# EAGLE design 72x8 control (EAGLE 8.7.0)
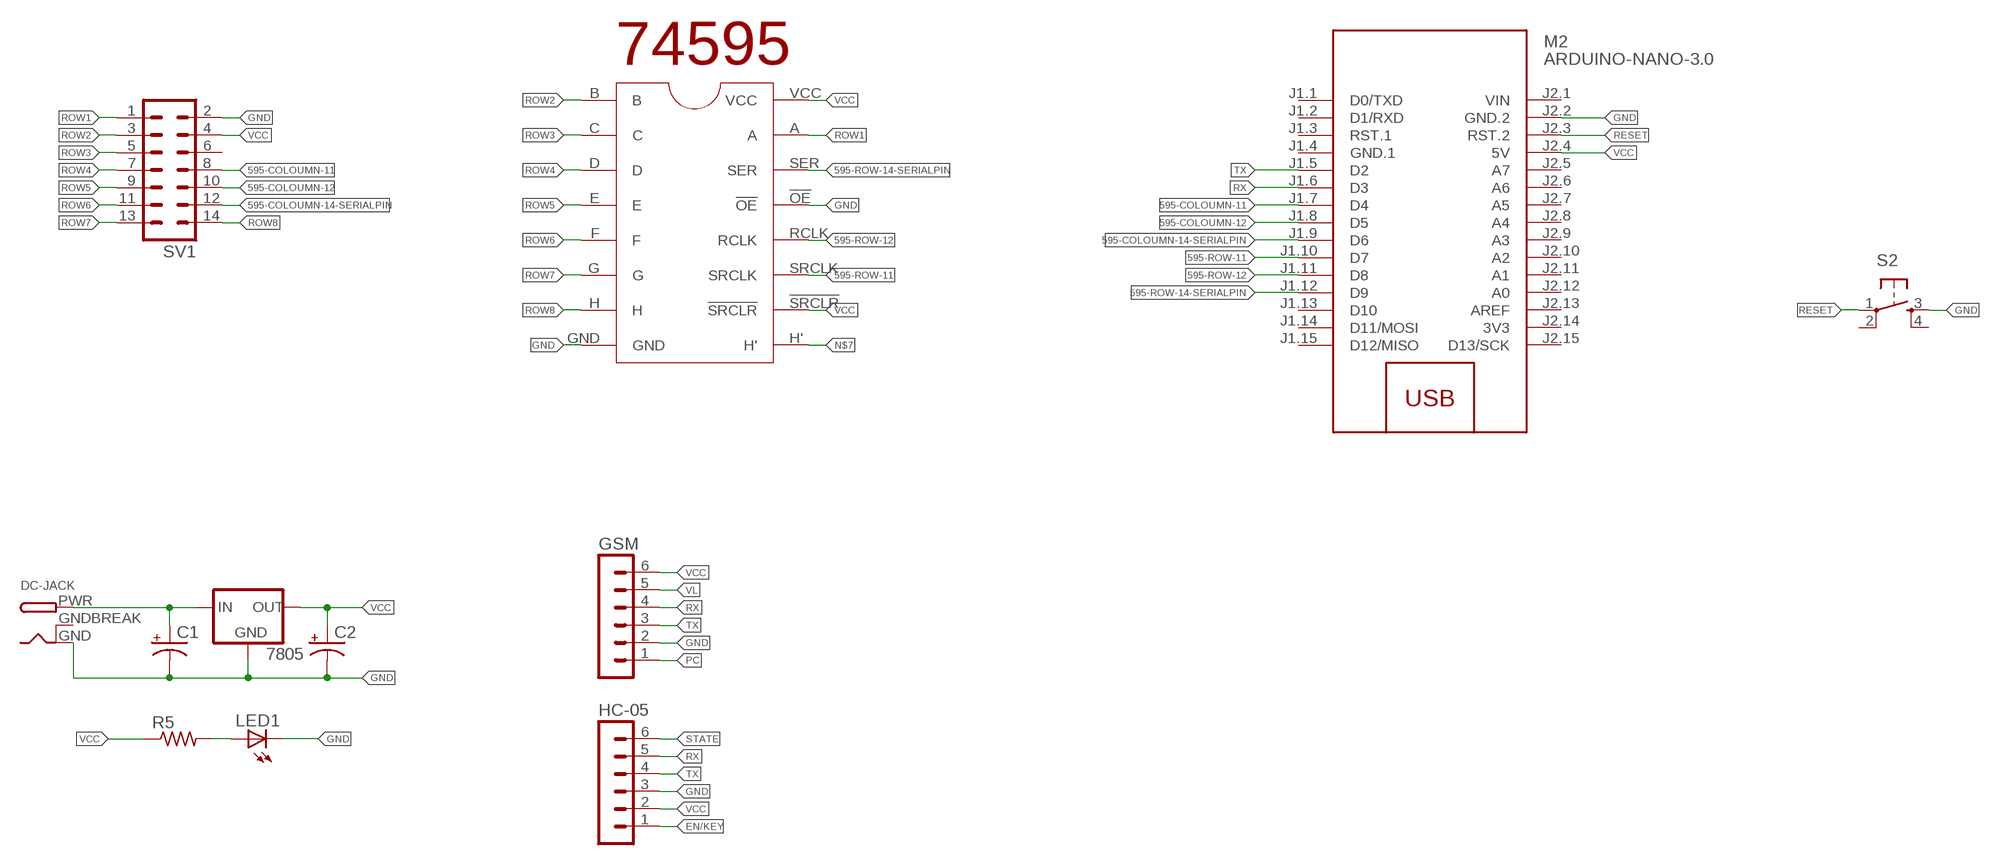
[diagram p0: schematic, sheet 1]

## Parts
1  74595  [DIL16]
7805  78XX-TO3  [TO3-78]
C1  CPOL-USE2-5  [E2-5]
C2  CPOL-USE2-5  [E2-5]
DC-JACK  DCBARRELPTH  [DCJACK_2MM_PTH]
GSM  MA06-1  [MA06-1]
HC-05  MA06-1  [MA06-1]
LED1  LED5MM  [LED5MM]
M2  ARDUINO-NANO-3.0  [ARDUINO-NANO-3.0]
R5  R-US_0207/10  [0207/10]
S2  TAC_SWITCHPTH  [TACTILE-PTH]
SV1  MA07-2  [MA07-2]

## Nets
12V: 7805.2(IN) C1.+ DC-JACK.PWR
595-COLOUMN-11: M2.J1.7(D4) SV1.8
595-COLOUMN-12: M2.J1.8(D5) SV1.10
595-COLOUMN-14-SERIALPIN: M2.J1.9(D6) SV1.12
595-ROW-11: 1.SRCLK M2.J1.10(D7)
595-ROW-12: 1.RCLK M2.J1.11(D8)
595-ROW-14-SERIALPIN: 1.SER M2.J1.12(D9)
EN/KEY: HC-05.1
GND: 1.!OE 1.GND 7805.3(GND) C1.- C2.- DC-JACK.GND GSM.2 HC-05.3 LED1.K(C) M2.J2.2(GND.2) S2.3 SV1.2
N$1: LED1.A R5.2
N$7: 1.H'
PC: GSM.1
RESET: M2.J2.3(RST.2) S2.1
ROW1: 1.A SV1.1
ROW2: 1.B SV1.3
ROW3: 1.C SV1.5
ROW4: 1.D SV1.7
ROW5: 1.E SV1.9
ROW6: 1.F SV1.11
ROW7: 1.G SV1.13
ROW8: 1.H SV1.14
RX: GSM.4 HC-05.5 M2.J1.6(D3)
STATE: HC-05.6
TX: GSM.3 HC-05.4 M2.J1.5(D2)
VCC: 1.!SRCLR 1.VCC 7805.1(OUT) C2.+ GSM.6 HC-05.2 M2.J2.4(5V) R5.1 SV1.4
VL: GSM.5
Unconnected: M2.J1.1(D0/TXD) M2.J1.2(D1/RXD) M2.J1.3(RST.1) M2.J1.13(D10) M2.J1.14(D11/MOSI) M2.J1.15(D12/MISO) M2.J2.5(A7) M2.J2.6(A6) M2.J2.7(A5) M2.J2.8(A4) M2.J2.9(A3) M2.J2.10(A2) M2.J2.11(A1) M2.J2.12(A0) M2.J2.13(AREF) M2.J2.15(D13/SCK) S2.2 S2.4 SV1.6

## Power pins joined to a net without a drawn wire
3V3: M2.J2.14(3V3)
GND.1: M2.J1.4(GND.1)
GNDBREAK: DC-JACK.GNDBREAK
VIN: M2.J2.1(VIN)

## Library data of the parts
1 = 74595(shifft in parallel out register):74595
7805 = v-reg:78XX-TO3: VOLTAGE REGULATOR
C1 C2 = adafruit:CPOL-US: POLARIZED CAPACITOR, American symbol
DC-JACK = adafruit:DCBARREL: 2.0mm DC Barrel Jack DCJACK_2MM_PTH - Through Hole Jack (4UConnector: 05537)
GSM HC-05 = con-lstb:MA06-1: PIN HEADER; OC_FARNELL: unknown; OC_NEWARK: unknown
LED1 = adafruit:LED: LED OSRAM: - CHIPLED LG R971, LG N971, LY N971, LG Q971, LY Q971, LO R971, LY R971 LH N974, LH R974 LS Q976, LO Q976, LY Q976 LO Q996 - Hyper CHIPLED LW Q18S LB Q993, LB Q99A, LB R99A - SideLED LS A670, LO A670, LY A670, LG A670, LP A670 LB A673, LV A673, LT A673, LW A673 LH A674 LY A675 LS A676, LA A676, LO A676, LY A676, LW A676 LS A679, LY A679, LG A679 - Hyper Micro SIDELED® LS Y876, LA Y876, LO Y876, LY Y876 LT Y87S - SmartLED LW L88C, LW L88S LB L89C, LB L89S, LG L890 LS L89K, LO L89K, LY L89K LS L896, LA L896, LO L896, LY L896 - TOPLED LS T670, LO T670, LY T670, LG T670, LP T670 LSG T670, LSP T670, LSY T670, LOP T670, LYG T670 LG T671, LOG T671, LSG T671 LB T673, LV T673, LT T673, LW T673 LH T674 LS T676, LA T676, LO T676, LY T676, LB T676, LH T676, LSB T676, LW T676 LB T67C, LV T67C, LT T67C, LS T67K, LO T67K, LY T67K, LW E67C LS E67B, LA E67B, LO E67B, LY E67B, LB E67C, LV E67C, LT E67C LW T67C LS T679, LY T679, LG T679 LS T770, LO T770, LY T770, LG T770, LP T770 LB T773, LV T773, LT T773, LW T773 LH T774 LS E675, LA E675, LY E675, LS T675 LS T776, LA T776, LO T776, LY T776, LB T776 LHGB T686 LT T68C, LB T68C - Hyper Mini TOPLED® LB M676 - Mini TOPLED Santana® LG M470 LS M47K, LO M47K, LY M47K Source: http://www.osram.convergy.de/
M2 = DIY-Modules:ARDUINO-NANO-3.0: Arduino Nano 3.0
R5 = adafruit:R-US_: RESISTOR, American symbol
S2 = SparkFun-Retired:TAC_SWITCH: Momentary Switch Button commonly used for reset or general input. Spark Fun Electronics SKU : COM-00097 SMT- SWCH-08247
SV1 = con-lstb:MA07-2: PIN HEADER; OC_FARNELL: unknown; OC_NEWARK: unknown

## Board
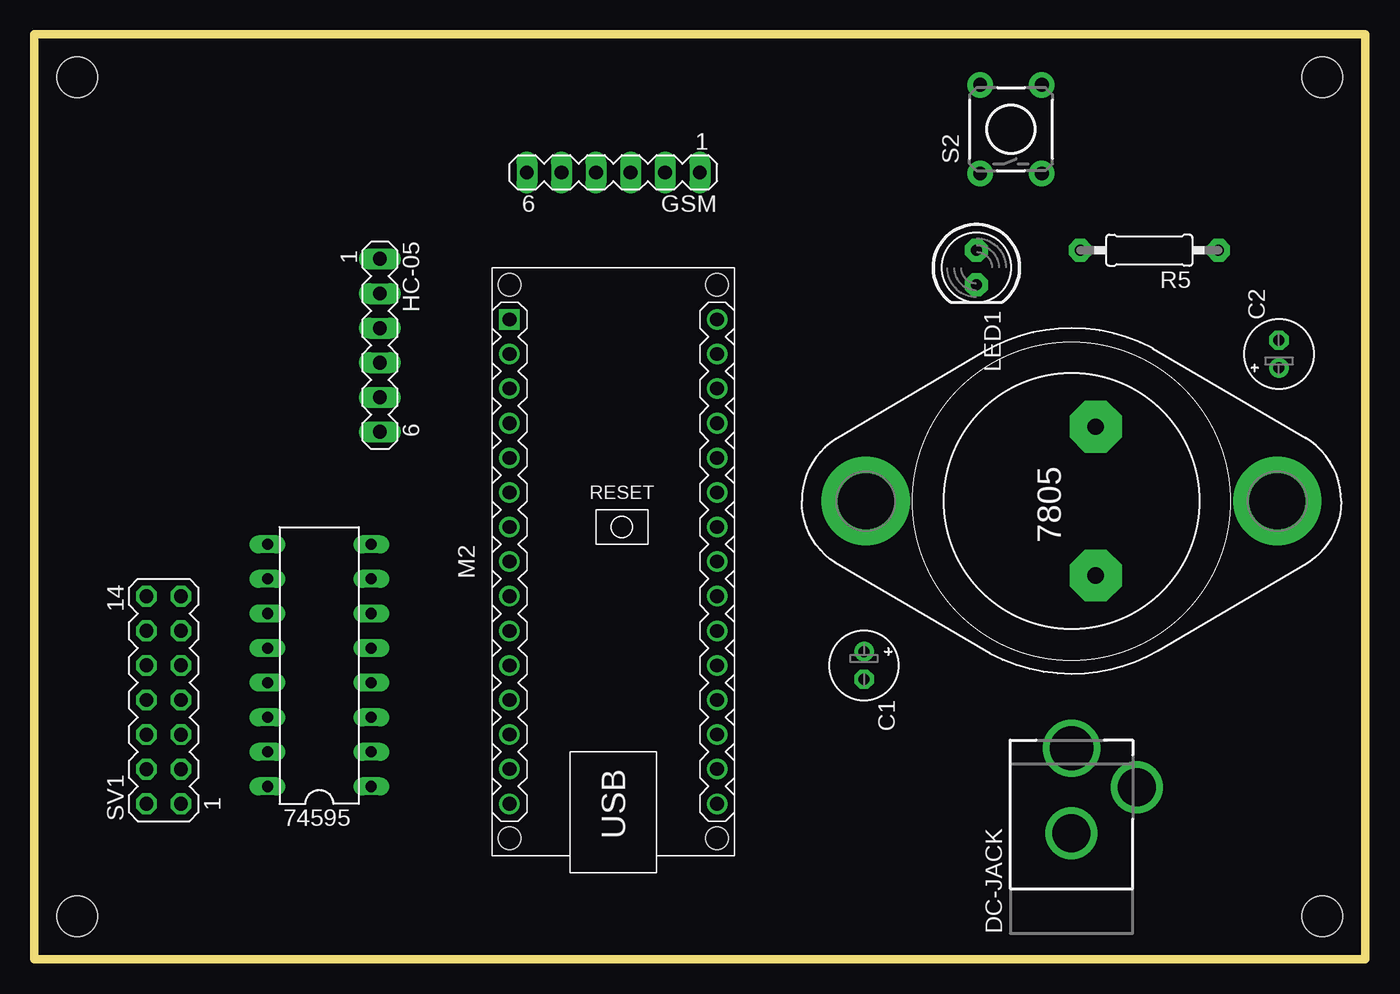
[diagram p1: board, top side]
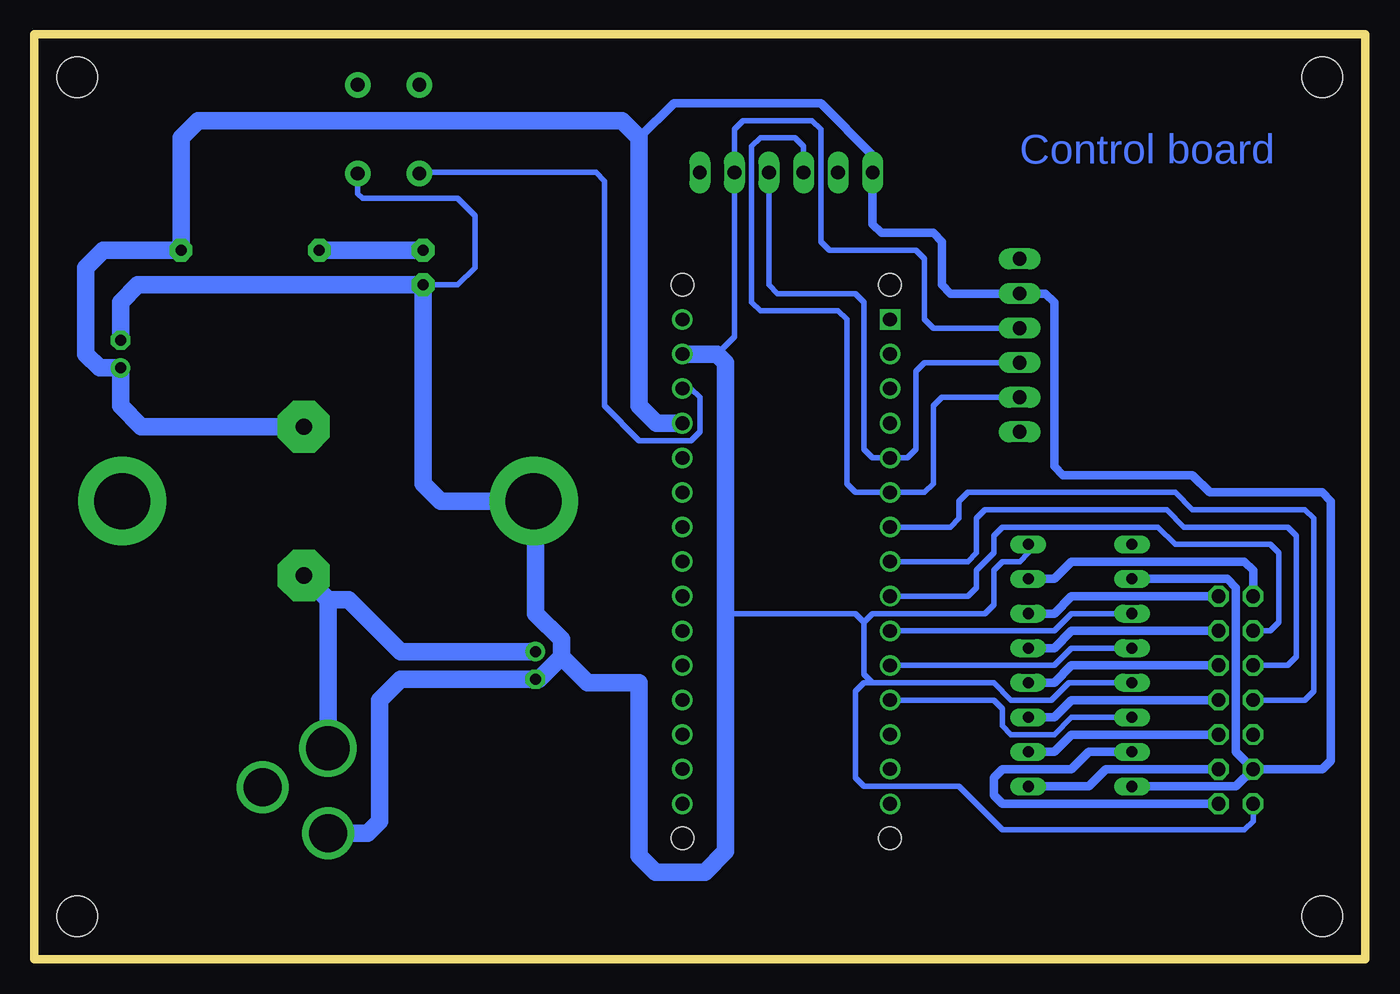
[diagram p2: board, bottom side, seen from below]

Size 97.79 x 67.94 mm. Coordinates in mm from the lower left corner, seen from the top.
Outline: 0,0 97.79,0 97.79,67.94 0,67.94 0,0
Copper layers (1*16): Top 0.035mm / dielectric 1.5mm / Bottom 0.035mm
Design rules "default": minimum track width 6mil, minimum drill 0.35mm, track to track 6mil, track to pad 6mil, pad to pad 6mil, via to via 6mil, smd to smd 6mil, copper to edge 40mil, drill to drill 6mil, minimum pad ring 10mil, minimum via ring 8mil, stop-mask expansion 4mil, vias tented up to drill 0mil, thermal gap 10mil
Holes 3 mm at 3.17,3.17 94.61,3.17 94.61,64.77 3.17,64.77

### Footprints (pad centres in the part's own frame; a part is rotated, then mirrored left to right if it is on the bottom)
DIL16 = drill 0.813 long: !OE 3.81,1.27; !SRCLR 3.81,-6.35; A 3.81,6.35; B -3.81,8.89; C -3.81,6.35; D -3.81,3.81; E -3.81,1.27; F -3.81,-1.27; G -3.81,-3.81; GND -3.81,-8.89; H -3.81,-6.35; H' 3.81,-8.89; RCLK 3.81,-1.27; SER 3.81,3.81; SRCLK 3.81,-3.81; VCC 3.81,8.89
TO3-78 = drill 1.194 pad 3.81 octagon: 1 -1.778,-5.461; 2 -1.778,5.461 | drill 4.115 pad 6.477: 3 15.113,0; 3@ -15.113,0
E2-5 = drill 0.813 pad 1.422: + -1.016,0 | drill 0.813 pad 1.422 octagon: - 1.016,0
DCJACK_2MM_PTH = drill 2.8: GND 0,7.35; GNDBREAK 4.8,10.75 | drill 3.2: PWR 0,13.6
MA06-1 = drill 1.016 long: 1 -6.35,0; 2 -3.81,0; 3 -1.27,0; 4 1.27,0; 5 3.81,0; 6 6.35,0
LED5MM = drill 0.813 pad 1.676 octagon: A -1.27,0; K 1.27,0
ARDUINO-NANO-3.0 = drill 1 square: J1.1 17.78,7.62 | drill 1: J1.2 15.24,7.62; J1.3 12.7,7.62; J1.4 10.16,7.62; J1.5 7.62,7.62; J1.6 5.08,7.62; J1.7 2.54,7.62; J1.8 0,7.62; J1.9 -2.54,7.62; J1.10 -5.08,7.62; J1.11 -7.62,7.62; J1.12 -10.16,7.62; J1.13 -12.7,7.62; J1.14 -15.24,7.62; J1.15 -17.78,7.62; J2.1 17.78,-7.62; J2.2 15.24,-7.62; J2.3 12.7,-7.62; J2.4 10.16,-7.62; J2.5 7.62,-7.62; J2.6 5.08,-7.62; J2.7 2.54,-7.62; J2.8 0,-7.62; J2.9 -2.54,-7.62; J2.10 -5.08,-7.62; J2.11 -7.62,-7.62; J2.12 -10.16,-7.62; J2.13 -12.7,-7.62; J2.14 -15.24,-7.62; J2.15 -17.78,-7.62 | hole 1.651: -20.32,7.62; -20.32,-7.62; 20.32,-7.62; 20.32,7.62
0207/10 = drill 0.813 pad 1.676 octagon: 1 -5.08,0; 2 5.08,0
TACTILE-PTH = drill 1.016 pad 1.88: 1 -3.251,2.261; 2 3.251,2.261; 3 -3.251,-2.261; 4 3.251,-2.261
MA07-2 = drill 1.016 octagon: 1 -7.62,-1.27; 2 -7.62,1.27; 3 -5.08,-1.27; 4 -5.08,1.27; 5 -2.54,-1.27; 6 -2.54,1.27; 7 0,-1.27; 8 0,1.27; 9 2.54,-1.27; 10 2.54,1.27; 11 5.08,-1.27; 12 5.08,1.27; 13 7.62,-1.27; 14 7.62,1.27

### Placement (x,y rotation side)
1  20.95,21.59 180 top
7805  76.2,33.66 180 top
C1  60.96,21.59 270 top
C2  91.44,44.45 90 top
DC-JACK  76.2,1.91 0 top
GSM  42.55,57.79 180 top
HC-05  25.4,45.09 270 top
LED1  69.22,50.8 270 top
M2  42.55,29.21 90 top
R5  81.91,52.07 180 top
S2  71.75,60.96 90 top
SV1  9.52,19.05 90 top

### Tracks (layer width: path | path; a pad name or v marks a point on that pad's centre or on a via)
12V
  Bottom 1.27: DC-JACK.PWR 76.2,26.42 | 76.2,26.42 7805.2 | C1.+ 70.87,22.61 74.68,26.42 76.2,26.42
595-COLOUMN-11
  Bottom 0.406: SV1.8 4.44,19.05 3.81,19.69 3.81,32.39 4.44,33.02 12.7,33.02 13.97,34.29 29.21,34.29 29.84,33.66 29.84,32.39 30.48,31.75 M2.J1.7
595-COLOUMN-12
  Bottom 0.406: SV1.10 5.71,21.59 5.08,22.23 5.08,31.12 5.71,31.75 13.33,31.75 14.6,33.02 27.94,33.02 28.57,32.39 28.57,29.84 29.21,29.21 M2.J1.8
595-COLOUMN-14-SERIALPIN
  Bottom 0.406: SV1.12 6.98,24.13 6.35,24.77 6.35,29.84 6.98,30.48 13.97,30.48 15.24,31.75 26.67,31.75 27.3,31.12 27.3,29.84 28.57,28.58 28.57,27.31 29.21,26.67 M2.J1.9
595-ROW-11
  Bottom 0.406: 1.SRCLK 21.59,25.4 22.86,24.13 M2.J1.10
595-ROW-12
  Bottom 0.406: 1.RCLK 21.59,22.86 22.86,21.59 M2.J1.11
595-ROW-14-SERIALPIN
  Bottom 0.406: 1.SER 21.59,17.78 22.86,16.51 26.03,16.51 26.67,17.14 26.67,18.42 27.3,19.05 M2.J1.12
GND
  Bottom 0.406: 1.GND 24.77,29.84 25.4,29.21 26.67,29.21 27.3,28.58 27.3,26.03 27.94,25.4 36.2,25.4 36.83,24.77 | 36.2,20.32 36.83,20.95 36.83,24.77 | 36.2,20.32 27.3,20.32 26.03,19.05 23.05,19.05 21.78,20.32 1.!OE | 36.83,24.77 37.46,25.4 46.99,25.4 | SV1.2 8.25,10.16 8.89,9.53 26.67,9.53 29.84,12.7 36.83,12.7 37.46,13.34 37.46,19.69 36.83,20.32 36.2,20.32 | 47.62,44.45 46.35,45.72 GSM.2 46.35,60.96 45.72,61.59 40.64,61.59 40,60.96 40,52.71 39.37,52.07 33.02,52.07 32.38,51.44 32.38,46.99 31.75,46.36 HC-05.3 | S2.3 74.02,56.24 73.66,55.88 66.67,55.88 65.41,54.61 65.41,50.8 66.67,49.53 LED1.K
  Bottom 1.27: DC-JACK.GND 73.3,9.25 72.39,10.16 72.39,19.05 70.87,20.57 C1.- 60.71,20.57 59.05,22.23 | 59.05,22.23 59.05,23.5 60.96,25.4 60.96,33.53 7805.3 67.94,33.66 69.22,34.92 LED1.K 90.17,49.53 91.44,48.26 C2.- | M2.J2.2 47.62,44.45 46.99,43.81 46.99,25.4 46.99,7.93 48.5,6.41 52.13,6.41 53.34,7.62 53.34,20.32 57.15,20.32 59.05,22.23
N$1
  Bottom 1.27: LED1.A R5.2
RESET
  Bottom 0.406: M2.J2.3 49.53,41.91 48.89,41.28 48.89,38.73 49.53,38.1 53.34,38.1 55.88,40.64 55.88,57.15 56.52,57.79 69.42,57.79 S2.1
ROW1
  Bottom 0.61: 1.A 20.32,15.24 21.59,13.97 26.67,13.97 27.3,13.34 27.3,12.06 26.67,11.43 SV1.1
ROW2
  Bottom 0.61: SV1.3 19.05,13.97 20.32,12.7 1.B
ROW3
  Bottom 0.61: 1.C 22.86,15.24 21.59,16.51 SV1.5
ROW4
  Bottom 0.61: 1.D 22.86,17.78 21.59,19.05 SV1.7
ROW5
  Bottom 0.61: 1.E 22.86,20.32 21.59,21.59 SV1.9
ROW6
  Bottom 0.61: 1.F 22.86,22.86 21.59,24.13 SV1.11
ROW7
  Bottom 0.61: 1.G 22.86,25.4 21.59,26.67 SV1.13
ROW8
  Bottom 0.61: 1.H 22.86,27.94 21.59,29.21 8.89,29.21 8.25,28.58 SV1.14
RX
  Bottom 0.406: 27.3,41.28 HC-05.5 31.11,41.28 31.75,40.64 31.75,34.92 32.38,34.29 M2.J1.6 37.46,34.29 38.1,34.92 38.1,46.99 38.73,47.62 44.45,47.62 45.09,48.26 45.09,59.69 44.45,60.33 41.91,60.33 41.27,59.69 GSM.4
TX
  Bottom 0.406: HC-05.4 32.38,43.81 33.02,43.18 33.02,37.47 33.66,36.83 M2.J1.5 36.2,36.83 36.83,37.47 36.83,48.26 37.46,48.89 43.18,48.89 43.81,49.53 GSM.3
VCC
  Bottom 0.61: 1.VCC 9.52,12.7 SV1.4 | SV1.4 9.52,15.24 9.52,27.31 10.16,27.94 1.!SRCLR | SV1.4 3.17,13.97 2.54,14.61 2.54,33.66 3.17,34.29 11.43,34.29 12.7,35.56 22.22,35.56 22.86,36.2 22.86,48.26 23.49,48.89 HC-05.2 30.48,48.89 31.11,49.53 31.11,52.71 31.75,53.34 35.56,53.34 36.2,53.98 GSM.6 36.2,59.05 40,62.87 50.8,62.87 53.34,60.33
  Bottom 1.27: 7805.1 89.92,39.12 91.44,40.64 C2.+ 92.96,43.43 93.98,44.45 93.98,50.8 92.71,52.07 R5.1 87,60.33 85.72,61.59 54.61,61.59 53.34,60.33 53.34,40.64 52.07,39.37 M2.J2.4

### Text on the board
Bottom: Control board